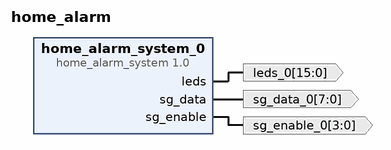
[diagram p0: block diagram of the top level]
# Vivado block design home_alarm, xc7a35tcpg236-1, Vivado 2025.1
create_bd_design home_alarm

create_bd_port -dir O -from 7 -to 0 -type data sg_data_0
create_bd_port -dir O -from 3 -to 0 -type data sg_enable_0
create_bd_port -dir O -from 15 -to 0 -type data leds_0

create_bd_cell -type ip -vlnv xilinx.com:hls:home_alarm_system:1.0 home_alarm_system_0

# ---- connections ----

connect_bd_net [get_bd_pins home_alarm_system_0/leds] [get_bd_ports leds_0]
connect_bd_net [get_bd_pins home_alarm_system_0/sg_data] [get_bd_ports sg_data_0]
connect_bd_net [get_bd_pins home_alarm_system_0/sg_enable] [get_bd_ports sg_enable_0]

validate_bd_design
save_bd_design
